# Altium schematic sheet Power_Sheet.SchDoc (part 2 of 3)
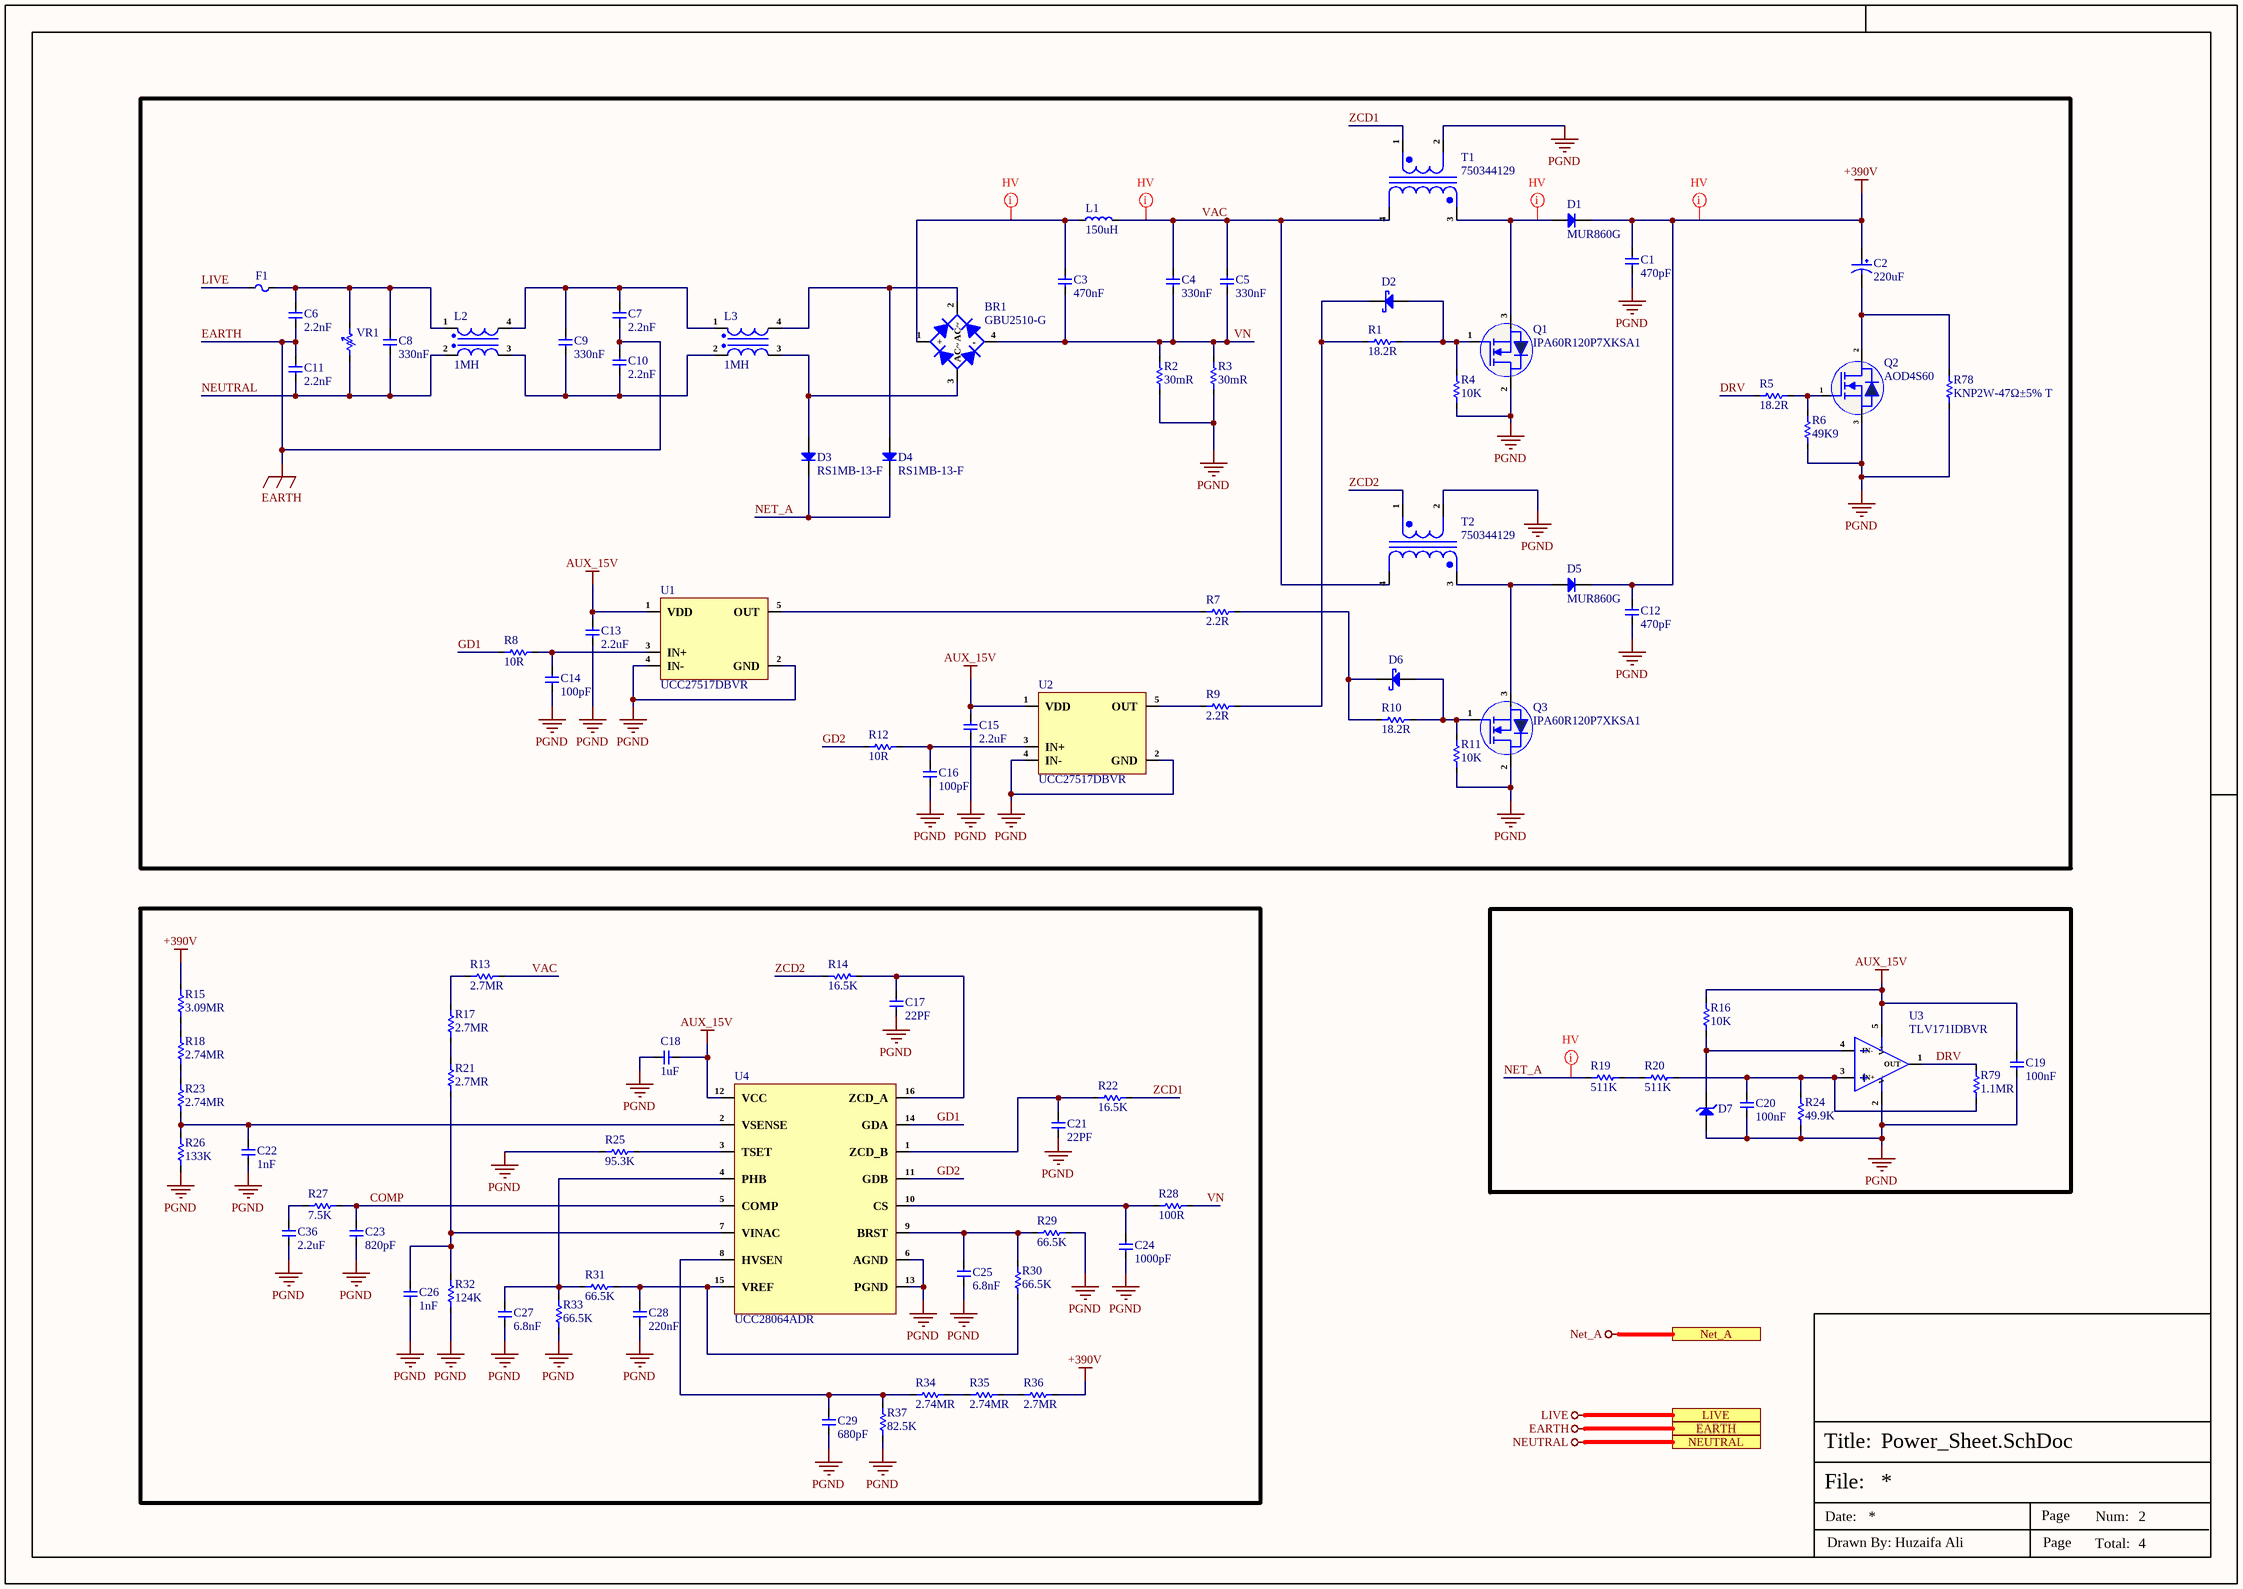
[diagram p1: Power_Sheet.SchDoc]
## Library data of the parts
BR1 = GBU2510-G: BRIDGE RECT 1PHASE 1KV 25A GBU; Manufacturer: Comchip; Item Type: Bridge Rectifier; Max Surge Current: 350A; Max Reverse Leakage Current: 10uA; Supplier: Arrow Electronics; LCSC Part Number: C3012677; Manufacturer Part Number: GBU2510-G; RoHS: Yes; Stock: 26; Pricing: 26=1.143, 100=1.0083, 500=0.9074, 1000=0.8027 (USD); Mounting Technology: Through Hole; Min Operating Temperature: -55°C; Max Operating Temperature: 150°C; Package Quantity: 200; Packaging: Rail/Tube; Series: -; Average Rectified Current: 25A; Lead Free: Lead Free; RoHS Compliant: Yes; ComponentLink1URL: https://datasheet.ciiva.com/886/gbu25005-gthru-gbu2510-grevc-886136.pdf?src-supplier=Digikey; ComponentLink1Description: https://datasheet.ciiva.com/886/gbu25005-gthru-gbu2510-grevc-886136.pdf?src-supplier=Digikey
C1 C12 = CC0805KRX7RBBB471: CAP CER 470PF 500V X7R 0805; Manufacturer: Yageo; Item Type: Capacitors; Tolerance: 10%; Supplier: Arrow Electronics; LCSC Part Number: C113867; Manufacturer Part Number: CC0805KRX7RBBB471; RoHS: Yes; Stock: 16000; Pricing: 4000=0.0157, 8000=0.0139, 24000=0.013, 48000=0.0125, 100000=0.0094 (USD); Mounting Technology: Surface Mount; Case/Package: 0805; Case Code (Imperial): 0805; Case Code (Metric): 2012; Min Operating Temperature: -55°C; Max Operating Temperature: 125°C; Voltage Rating (DC): 500V; Value: 470pF; Packaging: Tape and Reel; Package Quantity: 4000; Dielectric: X7R; Voltage Rating: 500V; Series: CC; Length: 0.079inch; Width: 0.049inch; Thickness: 0.037inch; RoHS Compliant: Yes; ComponentLink1URL: http://www.mouser.com/ds/2/447/Yageo_UPY-GP_NP0_16V-to-50V_9-358835.pdf?src-supplier=Mouser; ComponentLink1Description: http://www.mouser.com/ds/2/447/Yageo_UPY-GP_NP0_16V-to-50V_9-358835.pdf?src-supplier=Mouser; ComponentLink2URL: https://www.yageo.com/upload/media/product/products/datasheet/mlcc/UPY-NP0X7R_MV_100-to-630V_21.pdf?src-supplier=Digikey; ComponentLink2Description: https://www.yageo.com/upload/media/product/products/datasheet/mlcc/UPY-NP0X7R_MV_100-to-630V_21.pdf?src-supplier=Digikey; ComponentLink3URL: http://www.yageo.com/documents/recent/UPY-NP0X7R_MV_100-to-630V_19.pdf?src-supplier=Digikey; ComponentLink3Description: http://www.yageo.com/documents/recent/UPY-NP0X7R_MV_100-to-630V_19.pdf?src-supplier=Digikey
C2 = EWH2GM221O40OT: 220uF 400V ±20% Plugin,D22xL40mm Aluminum Electrolytic Capacitors - Leaded ROHS; Manufacturer: AISHI; Manufacturer Part Number: EWH2GM221O40OT; Package: Plugin,D22xL40mm; LCSC Part Number: C2988885; Item Type: Capacitors; ComponentLink1Description: LCSC; ComponentLink1URL: https://www.lcsc.com/product-detail/Aluminum-Electrolytic-Capacitors-Leaded_AISHI-Aihua-Group-EWH2GM221O40OT_C2988885.html
C3 = 450MPK474J: CAP FILM 0.47UF 5% 450VDC RADIAL; Manufacturer: Rubycon; Item Type: Film Capacitors; Dielectric Material: Polypropylene; Voltage Rating (DC): 450V; Supplier: Digikey; LCSC Part Number: C2798220; Manufacturer Part Number: 450MPK474J; RoHS: Yes; Stock: 4083; Pricing: 1=0.84, 10=0.605, 100=0.4311, 4000=0.26942, 8000=0.25962, 12000=0.25531 (USD); Mounting Technology: Through Hole; Case/Package: Radial; Min Operating Temperature: -40°C; Max Operating Temperature: 105°C; Package Quantity: 1; Value: 470nF; Tolerance: 5%; Packaging: Cut Tape; Termination: PC Pins; Series: MPK; Length: 0.709inch; Width: 0.256inch; Height - Seated (Max): 0.433inch; Lead Pitch: 0.591inch; RoHS Compliant: Yes; ComponentLink1URL: https://datasheet.ciiva.com/6281/e-mpk-6281321.pdf?src-supplier=Digikey; ComponentLink1Description: https://datasheet.ciiva.com/6281/e-mpk-6281321.pdf?src-supplier=Digikey; ComponentLink2URL: https://datasheet.ciiva.com/15021/e-mpk-15021932.pdf?src-supplier=Digikey; ComponentLink2Description: https://datasheet.ciiva.com/15021/e-mpk-15021932.pdf?src-supplier=Digikey
C4 C5 = MPP334J2J15AJ22800: 330nF -40℃~+105℃ ±5% 630V Plugin,P=15mm Polypropylene Film Capacitors (CBB) ROHS; Manufacturer: KNSCHA; Supplier: LCSC; LCSC Part Number: C506837; Manufacturer Part Number: MPP334J2J15AJ22800; RoHS: No; Item Type: Capacitors
C6 C7 C10 C11 = AY1222M47Y5UC63L0: CAP CER 2200PF 760VAC Y5U RADIAL; Item Type: Capacitor; LCSC Part Number: C1620433; ComponentLink1Description: LCSC; Supplier: Mouser; Supplier Part Number: 72-AY1222M47Y5UC63L0; RoHS: No; Category: Ceramic Capacitors; Stock: 23960; Pricing: 1=0.72, 10=0.395, 50=0.395, 100=0.326, 1000=0.216, 10000=0.19 (USD); ComponentLink2URL: http://www.farnell.com/datasheets/2719986.pdf?src-supplier=Farnell; ComponentLink2Description: http://www.farnell.com/datasheets/2719986.pdf?src-supplier=Farnell
C8 C9 = MPX334K31D2KN15800: 330nF ±10% X2 Plugin,P=15mm Safety Capacitors ROHS; Manufacturer: KNSCHA; Manufacturer Part Number: MPX334K31D2KN15800; Package: Plugin,P=15mm; LCSC Part Number: C504201; Item Type: Capacitors; ComponentLink1Description: LCSC; ComponentLink1URL: https://www.lcsc.com/product-detail/Safety-Capacitors_KNSCHA-MPX334K31D2KN15800_C504201.html
C13 C15 = CC0603KRX5R8BB225: CAP CER 2.2UF 25V X5R 0603; Manufacturer: Yageo; Tolerance: 10%; Item Type: Capacitor; Supplier 1: Digi-Key; Manufacturer Part Number: CC0603KRX5R8BB225; Stock 1: 687936; Pricing 1: 1=0.4, 10=0.276, 50=0.1932, 100=0.1656, 500=0.1242, 1000=0.10488 (USD); Mount: Surface Mount; Case/Package: 0603; Case Code (Metric): 1608; Case Code (Imperial): 0603; Weight: 7.1E-05oz; Min Operating Temperature: -55°C; Max Operating Temperature: 85°C; Packaging: Tape and Reel; Capacitance: 2.2uF; Dielectric: X5R; Voltage Rating: 25V; Termination: SMD/SMT; Resistor Type: Ceramic; Voltage Rating (DC): 25V; Package Quantity: 4000; Length: 1.6mm; Width: 0.031inch; Thickness: 0.037inch; Depth: 0.8mm; Radiation Hardening: No; Lead Free: Lead Free; Halogen Free: Halogen Free; RoHS Compliant: Yes; ComponentLink1URL: https://www.verical.com/server-webapp/html/getDatasheet?partID=782757&src-supplier=Verical; ComponentLink1Description: https://www.verical.com/server-webapp/html/getDatasheet?partID=782757&src-supplier=Verical; Supplier Part Number 1: 311-1786-1-ND; LCSC Part Number: C309478
C14 C16 = CC0402JRNPO9BN101: CAP CER 100PF 50V C0G/NPO 0402; Manufacturer: Yageo; Dielectric Material: Ceramic; Tolerance: 5%; Dielectric: C0G; Temperature Coefficient: 30ppm/°C; Insulation Resistance: 100GR; Item Type: Capacitor; Supplier: Future Electronics; Supplier Part Number: 8934564; Manufacturer Part Number: CC0402JRNPO9BN101; RoHS: Yes; Category: Ceramic Capacitors; Stock: 11720000; Pricing: 10000=0.002, 40000=0.0019, 150000=0.0018, 400000=0.0018, 1000000=0.0017 (USD); Mounting Technology: Surface Mount; Case/Package: 0402; Pins: 2; Case Code (Imperial): 0402; Case Code (Metric): 1005; Min Operating Temperature: -55°C; Max Operating Temperature: 125°C; Value: 100pF; Voltage Rating: 50V; Voltage Rating (DC): 50V; Packaging: Tape and Reel; Package Quantity: 1; Termination: SMD/SMT; Voltage: 50V; Series: CC; Length: 1mm; Width: 0.02inch; Height: 0.5mm; Thickness: 0.022inch; Depth: 0.5mm; Radiation Hardening: No; RoHS Compliant: Yes; Reach SVHC Compliant: No; Lead Free: Lead Free; ComponentLink1URL: https://datasheet.ciiva.com/11786/0900766b80d84fbf-11786101.pdf?src-supplier=Rs; ComponentLink1Description: https://datasheet.ciiva.com/11786/0900766b80d84fbf-11786101.pdf?src-supplier=Rs; ComponentLink2URL: https://datasheet.ciiva.com/23767/25787-23767888.pdf?src-supplier=Newark; ComponentLink2Description: https://datasheet.ciiva.com/23767/25787-23767888.pdf?src-supplier=Newark; ComponentLink3URL: https://datasheet.ciiva.com/28450/1443161-28450220.pdf?src-supplier=Element14; ComponentLink3Description: https://datasheet.ciiva.com/28450/1443161-28450220.pdf?src-supplier=Element14; ComponentLink4URL: https://datasheet.ciiva.com/8033/1443161-8033598.pdf?src-supplier=Element14; ComponentLink4Description: https://datasheet.ciiva.com/8033/1443161-8033598.pdf?src-supplier=Element14; ComponentLink5URL: https://datasheet.ciiva.com/143/mlccorderingcode-143990.pdf?src-supplier=Digi-Key; ComponentLink5Description: https://datasheet.ciiva.com/143/mlccorderingcode-143990.pdf?src-supplier=Digi-Key; ComponentLink6URL: https://datasheet.ciiva.com/143/mlccorderingcode-143989.pdf?src-supplier=Digi-Key; ComponentLink6Description: https://datasheet.ciiva.com/143/mlccorderingcode-143989.pdf?src-supplier=Digi-Key; ComponentLink7URL: https://datasheet.ciiva.com/143/mlccorderingcode-143991.pdf?src-supplier=Digi-Key; ComponentLink7Description: https://datasheet.ciiva.com/143/mlccorderingcode-143991.pdf?src-supplier=Digi-Key; LCSC Part Number: C106200
C17 C21 = CC0402JRNPO9BN220: CAP CER 22PF 50V C0G/NPO 0402; Manufacturer: Yageo; Dielectric Material: Ceramic; Tolerance: 5%; Dielectric: C0G; Temperature Coefficient: 30ppm/°C; Insulation Resistance: 100GR; Item Type: Capacitor; Supplier 1: Future Electronics; Manufacturer Part Number: CC0402JRNPO9BN220; RoHS: Yes; Category: Ceramic Capacitors; Stock 1: 200000; Pricing 1: 10000=0.00220, 40000=0.00210, 150000=0.00200, 400000=0.00190, 1000000=0.00180 (USD); Mounting Technology: Surface Mount; Case/Package: 0402; Pins: 2; Case Code (Metric): 1005; Case Code (Imperial): 0402; Min Operating Temperature: -55°C; Max Operating Temperature: 125°C; Value: 22pF; Voltage Rating: 50V; Packaging: Tape and Reel; Package Quantity: 1; Voltage Rating (DC): 50V; Termination: SMD/SMT; Resistor Type: Ceramic; Voltage: 50V; Series: CC; Length: 1mm; Width: 0.02inch; Height: 0.5mm; Thickness: 0.022inch; Depth: 0.5mm; Radiation Hardening: No; Reach SVHC Compliant: Yes; Lead Free: Lead Free; RoHS Compliant: Yes; ComponentLink1URL: https://datasheet.ciiva.com/5789/1443161-5789509.pdf?src-supplier=Farnell; ComponentLink1Description: https://datasheet.ciiva.com/5789/1443161-5789509.pdf?src-supplier=Farnell; ComponentLink2URL: https://datasheet.ciiva.com/8033/1443161-8033606.pdf?src-supplier=Element14; ComponentLink2Description: https://datasheet.ciiva.com/8033/1443161-8033606.pdf?src-supplier=Element14; ComponentLink3URL: https://datasheet.ciiva.com/7656/1132289-7656615.pdf?src-supplier=Element14; ComponentLink3Description: https://datasheet.ciiva.com/7656/1132289-7656615.pdf?src-supplier=Element14; ComponentLink4URL: https://datasheet.ciiva.com/8033/1443161-8033607.pdf?src-supplier=Element14; ComponentLink4Description: https://datasheet.ciiva.com/8033/1443161-8033607.pdf?src-supplier=Element14; ComponentLink5URL: https://datasheet.ciiva.com/8033/1443161-8033605.pdf?src-supplier=Element14; ComponentLink5Description: https://datasheet.ciiva.com/8033/1443161-8033605.pdf?src-supplier=Element14; ComponentLink6URL: https://datasheet.ciiva.com/143/mlccorderingcode-143987.pdf?src-supplier=Digi-Key; ComponentLink6Description: https://datasheet.ciiva.com/143/mlccorderingcode-143987.pdf?src-supplier=Digi-Key; ComponentLink7URL: https://datasheet.ciiva.com/143/mlccorderingcode-143986.pdf?src-supplier=Digi-Key; ComponentLink7Description: https://datasheet.ciiva.com/143/mlccorderingcode-143986.pdf?src-supplier=Digi-Key; ComponentLink8URL: https://datasheet.ciiva.com/143/mlccorderingcode-143988.pdf?src-supplier=Digi-Key; ComponentLink8Description: https://datasheet.ciiva.com/143/mlccorderingcode-143988.pdf?src-supplier=Digi-Key; ComponentLink9URL: https://datasheet.ciiva.com/5425/upy-gp-np0-16v-to-50v-8-5425483.pdf?src-supplier=Mouser; ComponentLink9Description: https://datasheet.ciiva.com/5425/upy-gp-np0-16v-to-50v-8-5425483.pdf?src-supplier=Mouser; ComponentLink10URL: https://datasheet.ciiva.com/15189/getdatasheetpartid-370074-15189117.pdf?src-supplier=Verical; ComponentLink10Description: https://datasheet.ciiva.com/15189/getdatasheetpartid-370074-15189117.pdf?src-supplier=Verical; Supplier Part Number 1: 9105957; LCSC Part Number: C106203
C18 = CC0603KRX5R8BB105: CAP CER 1UF 25V X5R 0603; Manufacturer: Yageo; Tolerance: 10%; Item Type: Capacitor; Supplier 1: Digi-Key; Manufacturer Part Number: CC0603KRX5R8BB105; RoHS: Yes; Category: Ceramic Capacitors; Stock 1: 919939; Pricing 1: 1=0.12000, 10=0.08400, 50=0.04760, 100=0.03940, 500=0.02764, 1000=0.02288 (USD); Mount: Surface Mount; Case/Package: 0603; Number of Pins: 2; Case Code (Metric): 1608; Case Code (Imperial): 0603; Min Operating Temperature: -55°C; Max Operating Temperature: 85°C; Capacitance: 1uF; Dielectric: X5R; Package Quantity: 1; Voltage Rating: 25V; Packaging: Tape and Reel; Termination: SMD/SMT; Voltage Rating (DC): 25V; Series: CC; Construction: Flat; Length: 1.6mm; Width: 0.031inch; Height: 0.8mm; Thickness: 0.035inch; Depth: 0.8mm; Radiation Hardening: No; REACH SVHC: No SVHC; Lead Free: Lead Free; Halogen Free: Halogen Free; RoHS Compliant: Yes; ComponentLink1URL: https://datasheet.ciiva.com/176/mlccorderingcode-176785.pdf?src-supplier=Digi-Key; ComponentLink1Description: https://datasheet.ciiva.com/176/mlccorderingcode-176785.pdf?src-supplier=Digi-Key; ComponentLink2URL: https://datasheet.ciiva.com/176/mlccorderingcode-176786.pdf?src-supplier=Digi-Key; ComponentLink2Description: https://datasheet.ciiva.com/176/mlccorderingcode-176786.pdf?src-supplier=Digi-Key; ComponentLink3URL: https://datasheet.ciiva.com/176/mlccorderingcode-176787.pdf?src-supplier=Digi-Key; ComponentLink3Description: https://datasheet.ciiva.com/176/mlccorderingcode-176787.pdf?src-supplier=Digi-Key; ComponentLink4URL: https://datasheet.ciiva.com/17436/upy-gphc-x5r-4v-to-50v-12-17436952.pdf?src-supplier=Avnet+Europe; ComponentLink4Description: https://datasheet.ciiva.com/17436/upy-gphc-x5r-4v-to-50v-12-17436952.pdf?src-supplier=Avnet+Europe; ComponentLink5URL: https://datasheet.ciiva.com/7978/1525783-7978171.pdf?src-supplier=Element14; ComponentLink5Description: https://datasheet.ciiva.com/7978/1525783-7978171.pdf?src-supplier=Element14; ComponentLink6URL: https://datasheet.ciiva.com/11586/upy-gphc-x5r-4v-to-50v-12-11586318.pdf?src-supplier=Avnet; ComponentLink6Description: https://datasheet.ciiva.com/11586/upy-gphc-x5r-4v-to-50v-12-11586318.pdf?src-supplier=Avnet; Supplier Part Number 1: 311-1445-1-ND; LCSC Part Number: C14664
C19 C20 = C1005X7R1H104KT000F: CAP CER 0.1UF 50V X7R 0402; Manufacturer: TDK; Tolerance: 10%; Voltage: 25V; Item Type: Capacitor; Supplier 1: Avnet; Manufacturer Part Number: C1005X7R1H104KT000F; RoHS: No; Category: Ceramic Capacitors; Dielectric: X7R; Supplier Part Number 1: C1005X7R1H104KT000F; LCSC Part Number: C361198; ComponentLink1Description: LCSC; ComponentLink1URL: https://www.lcsc.com/product-detail/Multilayer-Ceramic-Capacitors-MLCC-SMD-SMT_TDK-C1005X7R1H104KT000F_C361198.html
C22 = GRM1555C1H102JA01D: CAP CER 1000PF 50V C0G/NP0 0402; Manufacturer: Murata; Material: Ceramic; Tolerance: 5%; Dielectric: C0G; Insulation Resistance: 10GR; Temperature Coefficient: 30ppm/°C; Item Type: Capacitor; Supplier 1: Avnet; Manufacturer Part Number: GRM1555C1H102JA01D; RoHS: Yes; Category: Ceramic Capacitors; Stock 1: 800000; Pricing 1: 10000=0.00648, 20000=0.00613, 40000=0.00578, 60000=0.00543, 80000=0.00508, 100000=0.00473, 1000000=0.00438 (USD); Mount: Surface Mount; Case/Package: 0402; Number of Pins: 2; Case Code (Metric): 1005; Case Code (Imperial): 0402; Dielectric Material: Ceramic; Min Operating Temperature: -55°C; Max Operating Temperature: 125°C; Package Quantity: 1; Capacitance: 1nF; Voltage Rating: 50V; Packaging: Tape and Reel; Voltage Rating (DC): 50V; Termination: SMD/SMT; Voltage: 50V; Series: GRM; Construction: Flat; Length: 1mm; Width: 0.5mm; Height: 0.5mm; Thickness: 0.022inch; Depth: 0.5mm; Size: 0.5mm; Radiation Hardening: No; Reach SVHC Compliant: Yes; Lead Free: Lead Free; RoHS Compliant: Yes; ComponentLink1URL: https://datasheet.ciiva.com/34302/1855908-34302849.pdf?src-supplier=Jameco; ComponentLink1Description: https://datasheet.ciiva.com/34302/1855908-34302849.pdf?src-supplier=Jameco; ComponentLink2URL: https://datasheet.ciiva.com/132/product-132800.pdf?src-supplier=Digi-Key; ComponentLink2Description: https://datasheet.ciiva.com/132/product-132800.pdf?src-supplier=Digi-Key; ComponentLink3URL: https://datasheet.ciiva.com/132/grm1555c1h102ja01-01-132799.pdf?src-supplier=Digi-Key; ComponentLink3Description: https://datasheet.ciiva.com/132/grm1555c1h102ja01-01-132799.pdf?src-supplier=Digi-Key; ComponentLink4URL: https://datasheet.ciiva.com/11786/0900766b807a1cab-11786727.pdf?src-supplier=RSComponents; ComponentLink4Description: https://datasheet.ciiva.com/11786/0900766b807a1cab-11786727.pdf?src-supplier=RSComponents; ComponentLink5URL: https://datasheet.ciiva.com/29200/453569-da-01-en-vs-kondensator-0402-29200121.pdf?src-supplier=Conrad; ComponentLink5Description: https://datasheet.ciiva.com/29200/453569-da-01-en-vs-kondensator-0402-29200121.pdf?src-supplier=Conrad; ComponentLink6URL: https://datasheet.ciiva.com/7828/4360-7828821.pdf?src-supplier=Element14; ComponentLink6Description: https://datasheet.ciiva.com/7828/4360-7828821.pdf?src-supplier=Element14; ComponentLink7URL: https://datasheet.ciiva.com/14116/grmseries-tc-hitype-eng-14116919.pdf?src-supplier=Distrelec; ComponentLink7Description: https://datasheet.ciiva.com/14116/grmseries-tc-hitype-eng-14116919.pdf?src-supplier=Distrelec; ComponentLink8URL: https://datasheet.ciiva.com/14116/grmseries-tc-hitype-eng-14116858.pdf?src-supplier=Distrelec; ComponentLink8Description: https://datasheet.ciiva.com/14116/grmseries-tc-hitype-eng-14116858.pdf?src-supplier=Distrelec; ComponentLink9URL: https://datasheet.ciiva.com/132/grm1555c1h102ja01-01-132801.pdf?src-supplier=Digi-Key; ComponentLink9Description: https://datasheet.ciiva.com/132/grm1555c1h102ja01-01-132801.pdf?src-supplier=Digi-Key; ComponentLink10URL: https://datasheet.ciiva.com/7828/1747436-7828822.pdf?src-supplier=Element14; ComponentLink10Description: https://datasheet.ciiva.com/7828/1747436-7828822.pdf?src-supplier=Element14; Supplier Part Number 1: GRM1555C1H102JA01D; LCSC Part Number: C76947
C23 = CC0603JRNPO9BN821: CAP CER 820PF 50V C0G/NPO 0603; Manufacturer: Yageo; Item Type: Capacitors; Tolerance: 5%; Dielectric: C0G; Supplier: Arrow Electronics; LCSC Part Number: C107057; Manufacturer Part Number: CC0603JRNPO9BN821; RoHS: Yes; Stock: 772000; Pricing: 4000=0.0129, 24000=0.0087, 48000=0.0086 (USD); Mounting Technology: Surface Mount; Case/Package: 0603; Pins: 2; Case Code (Imperial): 0603; Case Code (Metric): 1608; Min Operating Temperature: -55°C; Max Operating Temperature: 125°C; Packaging: Tape and Reel; Value: 820pF; Voltage Rating: 50V; Voltage Rating (DC): 50V; Termination: SMD/SMT; Series: CC; Length: 1.6mm; Width: 0.031inch; Height: 0.8mm; Thickness: 0.035inch; Depth: 0.8mm; Radiation Hardening: No; Lead Free: Lead Free; RoHS Compliant: Yes; ComponentLink1URL: https://datasheet.ciiva.com/26829/getdatasheetpartid-403541-26829388.pdf?src-supplier=Verical; ComponentLink1Description: https://datasheet.ciiva.com/26829/getdatasheetpartid-403541-26829388.pdf?src-supplier=Verical
C24 = CL10C102JB8NNNC: CAP CER 1000PF 50V C0G/NP0 0603; Manufacturer: Samsung; Material: Ceramic; Tolerance: 5%; Capacitance: 1nF; Dielectric: C0G; Temperature Coefficient: 300ppm/°C; Item Type: Capacitor; Supplier 1: RSComponents; Manufacturer Part Number: CL10C102JB8NNNC; RoHS: Yes; Category: Ceramic Capacitors; Stock 1: 616000; Pricing 1: 4000=0.00600, 12000=0.00600, 20000=0.00600, 40000=0.00500, 100000=0.00500 (GBP); Mount: Surface Mount; Case/Package: 0603; Case Code (Metric): 1608; Case Code (Imperial): 0603; Min Operating Temperature: -55°C; Max Operating Temperature: 125°C; Voltage: 50V; Voltage Rating (DC): 50V; Voltage Rating: 50V; Packaging: Tape and Reel; Package Quantity: 1; Series: CL; Length: 1.6mm; Width: 0.031inch; Height: 0.8mm; Depth: 0.8mm; Thickness: 0.035inch; Radiation Hardening: No; Lead Free: Lead Free; RoHS Compliant: Yes; ComponentLink1URL: https://datasheet.ciiva.com/15195/getdatasheetpartid-354056-15195790.pdf?src-supplier=Verical; ComponentLink1Description: https://datasheet.ciiva.com/15195/getdatasheetpartid-354056-15195790.pdf?src-supplier=Verical; ComponentLink2URL: https://datasheet.ciiva.com/29198/458273-da-01-en-vs-kondensator-0603-29198494.pdf?src-supplier=Conrad; ComponentLink2Description: https://datasheet.ciiva.com/29198/458273-da-01-en-vs-kondensator-0603-29198494.pdf?src-supplier=Conrad; ComponentLink3URL: https://datasheet.ciiva.com/26310/mlcc-catalogdownload2013-eng-26310329.pdf?src-supplier=Distrelec; ComponentLink3Description: https://datasheet.ciiva.com/26310/mlcc-catalogdownload2013-eng-26310329.pdf?src-supplier=Distrelec; Supplier Part Number 1: 7665279; LCSC Part Number: C163508
C25 C27 = 0603B682K500NT: 50V 6.8nF X7R ±10% 0603; Manufacturer: FH; Item Type: Capacitor; ComponentLink1Description: LCSC; ComponentLink1URL: https://www.lcsc.com/product-detail/Multilayer-Ceramic-Capacitors-MLCC-SMD-SMT_FH-Guangdong-Fenghua-Advanced-Tech-0603B682K500NT_C1631.html; Manufacturer Part Number: 0603B682K500NT; Footprint: 0603; Value: 6.8nF; LCSC Part Number: C1631
C26 = 06031C102JAT2A: CAP CER 1000PF 100V X7R 0603; Manufacturer: Kyocera AVX; Item Type: Capacitor; Material: 4241ConductorMaterial; Supplier: Future Electronics; LCSC Part Number: C2179225; Manufacturer Part Number: 06031C102JAT2A; RoHS: Yes; Stock: 32000; Pricing: 4000=0.0243, 12000=0.0234, 20000=0.023, 40000=0.0225, 80000=0.0216 (USD); Lead Free: 5697LeadFree; ComponentLink1URL: https://datasheet.ciiva.com/27056/2011951-27056177.pdf?src-supplier=Jameco; ComponentLink1Description: https://datasheet.ciiva.com/27056/2011951-27056177.pdf?src-supplier=Jameco; ComponentLink2URL: https://datasheet.ciiva.com/2987/cx7r-2987732.pdf?src-supplier=Avnet; ComponentLink2Description: https://datasheet.ciiva.com/2987/cx7r-2987732.pdf?src-supplier=Avnet; ComponentLink3URL: https://datasheet.ciiva.com/151/cx7r-151600.pdf?src-supplier=Digikey; ComponentLink3Description: https://datasheet.ciiva.com/151/cx7r-151600.pdf?src-supplier=Digikey; ComponentLink4URL: https://datasheet.ciiva.com/151/cx7r-151601.pdf?src-supplier=Digikey; ComponentLink4Description: https://datasheet.ciiva.com/151/cx7r-151601.pdf?src-supplier=Digikey; ComponentLink5URL: https://datasheet.ciiva.com/151/cx7r-151602.pdf?src-supplier=Digikey; ComponentLink5Description: https://datasheet.ciiva.com/151/cx7r-151602.pdf?src-supplier=Digikey; ComponentLink6URL: https://datasheet.ciiva.com/1124/1679506-1124194.pdf?src-supplier=Element14; ComponentLink6Description: https://datasheet.ciiva.com/1124/1679506-1124194.pdf?src-supplier=Element14; ComponentLink7URL: https://datasheet.ciiva.com/1124/1679506-1124195.pdf?src-supplier=Element14; ComponentLink7Description: https://datasheet.ciiva.com/1124/1679506-1124195.pdf?src-supplier=Element14; ComponentLink8URL: https://datasheet.ciiva.com/7855/1679506-7855032.pdf?src-supplier=Element14; ComponentLink8Description: https://datasheet.ciiva.com/7855/1679506-7855032.pdf?src-supplier=Element14; ComponentLink9URL: https://datasheet.ciiva.com/16286/cx7r-16286463.pdf?src-supplier=Future+Electronics; ComponentLink9Description: https://datasheet.ciiva.com/16286/cx7r-16286463.pdf?src-supplier=Future+Electronics
C28 = CC1206JKX7R9BB224: CAP CER 0.22UF 50V X7R 1206; Manufacturer: Yageo; Item Type: Capacitor; Supplier: Future Electronics; Supplier Part Number: 4639209; Manufacturer Part Number: CC1206JKX7R9BB224; RoHS: Yes; Category: Ceramic Capacitors; Stock: 3000; Pricing: 3000=0.0381, 9000=0.0366, 15000=0.036, 30000=0.0351, 60000=0.0337 (USD); ComponentLink1URL: https://datasheet.ciiva.com/13210/upy-gp-np0-16v-to-50v-8-13210060.pdf?src-supplier=Mouser; ComponentLink1Description: https://datasheet.ciiva.com/13210/upy-gp-np0-16v-to-50v-8-13210060.pdf?src-supplier=Mouser; ComponentLink2URL: https://datasheet.ciiva.com/11466/upy-gphc-x7r-6-3v-to-50v-8-11466351.pdf?src-supplier=Avnet; ComponentLink2Description: https://datasheet.ciiva.com/11466/upy-gphc-x7r-6-3v-to-50v-8-11466351.pdf?src-supplier=Avnet; LCSC Part Number: C527274
C29 = CC0603JRNPO9BN681: CAP CER 680PF 50V C0G/NPO 0603; Manufacturer: Yageo; Item Type: Capacitors; Insulation Resistance: 100GR; Supplier: Arrow Electronics; LCSC Part Number: C107055; Manufacturer Part Number: CC0603JRNPO9BN681; RoHS: Yes; Stock: 1227; Pricing: 1=0.0632, 10=0.035, 25=0.0308, 100=0.0222, 250=0.0221, 500=0.022, 1000=0.0132 (USD); Voltage Rating (AC): 50V; Halogen Free: 5694HalogenFree; Lead Free: 5697LeadFree; ComponentLink1URL: https://datasheet.ciiva.com/11786/0900766b8079c870-11786425.pdf?src-supplier=Rs; ComponentLink1Description: https://datasheet.ciiva.com/11786/0900766b8079c870-11786425.pdf?src-supplier=Rs; ComponentLink2URL: https://datasheet.ciiva.com/7978/1132289-7978154.pdf?src-supplier=Element14; ComponentLink2Description: https://datasheet.ciiva.com/7978/1132289-7978154.pdf?src-supplier=Element14; ComponentLink3URL: https://datasheet.ciiva.com/11587/upy-gp-np0-16v-to-50v-8-11587327.pdf?src-supplier=Avnet; ComponentLink3Description: https://datasheet.ciiva.com/11587/upy-gp-np0-16v-to-50v-8-11587327.pdf?src-supplier=Avnet; ComponentLink4URL: https://datasheet.ciiva.com/176/mlccorderingcode-176594.pdf?src-supplier=Digikey; ComponentLink4Description: https://datasheet.ciiva.com/176/mlccorderingcode-176594.pdf?src-supplier=Digikey; ComponentLink5URL: https://datasheet.ciiva.com/176/mlccorderingcode-176595.pdf?src-supplier=Digikey; ComponentLink5Description: https://datasheet.ciiva.com/176/mlccorderingcode-176595.pdf?src-supplier=Digikey; ComponentLink6URL: https://datasheet.ciiva.com/176/mlccorderingcode-176596.pdf?src-supplier=Digikey; ComponentLink6Description: https://datasheet.ciiva.com/176/mlccorderingcode-176596.pdf?src-supplier=Digikey; ComponentLink7URL: https://datasheet.ciiva.com/15165/getdatasheetpartid-26164-15165031.pdf?src-supplier=Verical; ComponentLink7Description: https://datasheet.ciiva.com/15165/getdatasheetpartid-26164-15165031.pdf?src-supplier=Verical
C36 = CC0805KKX5R8BB225: CAP CER 2.2UF 25V X5R 0805; Manufacturer: Yageo; Tolerance: 10%; Supplier 1: Mouser; Manufacturer Part Number: CC0805KKX5R8BB225; RoHS: Yes; Category: Ceramic Capacitors; Stock 1: 2849; Pricing 1: 1=0.33000, 10=0.15100, 50=0.15100, 100=0.14800, 500=0.14600, 1000=0.14500, 3000=0.14400, 10000=0.14400 (USD); Mount: Surface Mount; Case/Package: 0805; Case Code (Metric): 2012; Case Code (Imperial): 0805; Min Operating Temperature: -55°C; Max Operating Temperature: 85°C; Capacitance: 2.2uF; Dielectric: X5R; Voltage Rating: 25V; Voltage Rating (DC): 25V; Packaging: Tape and Reel; Resistor Type: Ceramic; Series: CC; Construction: Flat; Length: 2mm; Width: 0.049inch; Height: 0.85mm; Depth: 1.25mm; Thickness: 0.057inch; Radiation Hardening: No; Lead Free: Lead Free; Halogen Free: Halogen Free; RoHS Compliant: Yes; ComponentLink1URL: https://datasheet.ciiva.com/11583/upy-gphc-x5r-4v-to-50v-12-11583590.pdf?src-supplier=Avnet; ComponentLink1Description: https://datasheet.ciiva.com/11583/upy-gphc-x5r-4v-to-50v-12-11583590.pdf?src-supplier=Avnet; Supplier Part Number 1: 603-CC805KKX5R8BB225; LCSC Part Number: C277526
D1 D5 = MUR860G: DIODE GEN PURP 600V 8A TO220-2; Manufacturer: ON Semiconductor; Supplier: Future Electronics; LCSC Part Number: C50428; Manufacturer Part Number: MUR860G; RoHS: Yes; Item Type: Diode; Stock: 4012; Pricing: 50=0.565, 200=0.54, 750=0.515, 1500=0.505, 3750=0.475 (USD); ComponentLink1URL: https://datasheet.ciiva.com/14169/zamur840-860-data-e-14169160.pdf?src-supplier=Distrelec; ComponentLink1Description: https://datasheet.ciiva.com/14169/zamur840-860-data-e-14169160.pdf?src-supplier=Distrelec; ComponentLink2URL: https://datasheet.ciiva.com/15144/getdatasheetpartid-103084-15144871.pdf?src-supplier=Verical; ComponentLink2Description: https://datasheet.ciiva.com/15144/getdatasheetpartid-103084-15144871.pdf?src-supplier=Verical; ComponentLink3URL: https://datasheet.ciiva.com/14557/70099562-14557677.pdf?src-supplier=Allied+Electronics; ComponentLink3Description: https://datasheet.ciiva.com/14557/70099562-14557677.pdf?src-supplier=Allied+Electronics; ComponentLink4URL: https://datasheet.ciiva.com/8299/mur820-d-8299771.pdf?src-supplier=Avnet; ComponentLink4Description: https://datasheet.ciiva.com/8299/mur820-d-8299771.pdf?src-supplier=Avnet; ComponentLink5URL: https://datasheet.ciiva.com/916/mur820-d-916462.pdf?src-supplier=Digikey; ComponentLink5Description: https://datasheet.ciiva.com/916/mur820-d-916462.pdf?src-supplier=Digikey; ComponentLink6URL: https://datasheet.ciiva.com/16210/mur820-d-16210191.pdf?src-supplier=Future+Electronics; ComponentLink6Description: https://datasheet.ciiva.com/16210/mur820-d-16210191.pdf?src-supplier=Future+Electronics
D2 D6 = BAT54HT1G: 30V Independent Type 1V@100mA 200mA SOD-323 Schottky Diodes ROHS; Manufacturer: FUXINSEMI; Item Type: Diode; Manufacturer Part Number: BAT54HT1G; Package: SOD-323; LCSC Part Number: C7422626; ComponentLink1Description: LCSC; ComponentLink1URL: https://www.lcsc.com/product-detail/Schottky-Diodes_FUXINSEMI-BAT54HT1G_C7422626.html
D3 D4 = RS1MB-13-F: DIODE GEN PURP 1KV 1A SMB; Manufacturer: Diodes; Max Reverse Current: 5uA; Reverse Recovery Time: 500ns; Peak Non-Repetitive Surge Current: 30A; Forward Voltage: 1.3V; Polarity: Standard; Value: 15pF; Supplier: Future Electronics; LCSC Part Number: C154864; Manufacturer Part Number: RS1MB-13-F; RoHS: Yes; Item Type: Diodes; Stock: 45000; Pricing: 3000=0.0825, 6000=0.093, 9000=0.0794, 12000=0.0905, 15000=0.078, 30000=0.0761, 60000=0.0732 (USD); Mounting Technology: Surface Mount; Case/Package: SMB; Pins: 2; Weight: 0.00328oz; Min Operating Temperature: -65°C; Max Operating Temperature: 150°C; Package Quantity: 3000; Packaging: Tape and Reel; Forward Current: 1A; Max Repetitive Reverse Voltage (Vrrm): 1kV; Output Current: 1A; Series: -; Max Surge Current: 30A; Recovery Time: 500ns; Reverse Voltage (DC): 1kV; Average Rectified Current: 1A; Voltage Rating (DC): 1kV; Current Rating: 1A; Max Reverse Voltage (DC): 1kV; Reverse Recovery Time-Max: 500ns; Length: 4.57mm; Width: 3.94mm; Height: 2.42mm; Radiation Hardening: No; Lead Free: Lead Free; RoHS Compliant: Yes; ComponentLink1URL: https://datasheet.ciiva.com/8301/ds15002-8301721.pdf?src-supplier=Avnet; ComponentLink1Description: https://datasheet.ciiva.com/8301/ds15002-8301721.pdf?src-supplier=Avnet; ComponentLink2URL: https://datasheet.ciiva.com/26818/getdatasheetpartid-91887-26818092.pdf?src-supplier=Verical; ComponentLink2Description: https://datasheet.ciiva.com/26818/getdatasheetpartid-91887-26818092.pdf?src-supplier=Verical; ComponentLink3URL: https://datasheet.ciiva.com/8301/ds15002-8301350.pdf?src-supplier=Avnet; ComponentLink3Description: https://datasheet.ciiva.com/8301/ds15002-8301350.pdf?src-supplier=Avnet
D7 = BZT52C5V1S-7-F: DIODE ZENER 5.1V 200MW SOD323; Manufacturer: Diodes; Max Reverse Leakage Current: 1uA; Tolerance: 6%; Forward Voltage: 900mV; Impedance: 60R; Zener Current: 5mA; Output Current: 50mA; ESD Protection: No; Supplier: Future Electronics; LCSC Part Number: C151348; Manufacturer Part Number: BZT52C5V1S-7-F; RoHS: Yes; Item Type: Diodes; Stock: 30000; Pricing: 3000=0.0261, 9000=0.0252, 15000=0.0248, 60000=0.0236, 90000=0.0229 (USD); Mounting Technology: Surface Mount; Pins: 2; Weight: 0.000173oz; Contact Plating: Tin,Matte; Min Operating Temperature: -65°C; Max Operating Temperature: 150°C; Max Power Dissipation: 200mW; Zener Voltage: 5.1V; Packaging: Tape and Reel; Package Quantity: 3000; Power Dissipation: 200mW; Voltage Tolerance: 6%; Test Current: 5mA; Working Voltage: 5.1V; Max Reverse Current: 1uA; Termination: SMD/SMT; Power Rating: 200mW; Voltage Rating (DC): 5.1V; Series: -; Length: 1.8mm; Width: 1.4mm; Height: 1mm; Radiation Hardening: No; Lead Free: Lead Free; RoHS Compliant: Yes; ComponentLink1URL: https://datasheet.ciiva.com/15142/getdatasheetpartid-61177-15142295.pdf?src-supplier=Verical; ComponentLink1Description: https://datasheet.ciiva.com/15142/getdatasheetpartid-61177-15142295.pdf?src-supplier=Verical; ComponentLink2URL: https://datasheet.ciiva.com/25623/0900766b8104c1f1-25623741.pdf?src-supplier=Rs; ComponentLink2Description: https://datasheet.ciiva.com/25623/0900766b8104c1f1-25623741.pdf?src-supplier=Rs
F1 = 0501010.WR1: 150A SMD Fuse 10A 32V 1206 Disposable fuses ROHS; Manufacturer: Littelfuse; Manufacturer Part Number: 0501010.WR1; Package: 1206; LCSC Part Number: C207003; Item Type: Fuses; ComponentLink1Description: LCSC; ComponentLink1URL: https://www.lcsc.com/product-detail/Disposable-fuses_Littelfuse-0501010-WR1_C207003.html
L1 = 7447076: FIXED IND 150UH 5A 45 MOHM TH; Manufacturer: Wurth Electronics; Item Type: Inductors; Supplier: Mouser; Manufacturer Part Number: 7447076; RoHS: Yes; Stock: 602; Pricing: 1=5.45, 10=5.19, 50=4.84, 100=4.57, 1000=4.12, 10000=4.12 (USD); ComponentLink1URL: https://datasheet.ciiva.com/11796/0900766b804e2e81-11796524.pdf?src-supplier=Rs; ComponentLink1Description: https://datasheet.ciiva.com/11796/0900766b804e2e81-11796524.pdf?src-supplier=Rs; ComponentLink2URL: https://datasheet.ciiva.com/6697/7447076-6697107.pdf?src-supplier=Digikey; ComponentLink2Description: https://datasheet.ciiva.com/6697/7447076-6697107.pdf?src-supplier=Digikey; ComponentLink3URL: https://datasheet.ciiva.com/7695/7447076-7695687.pdf?src-supplier=Element14; ComponentLink3Description: https://datasheet.ciiva.com/7695/7447076-7695687.pdf?src-supplier=Element14; Supplier Part Number: 710-7447076
L2 L3 = 7448031501: CMC 1MH 15A 2LN TH; Manufacturer: Wurth Electronics; Number of Lines: 2; Voltage Rating (AC): 250V; Shielding: Unshielded; Tolerance: 50%; Test Frequency: 10kHz; Item Type: Inductor; Supplier: Mouser; Supplier Part Number: 710-7448031501; Manufacturer Part Number: 7448031501; RoHS: Yes; Category: Common Mode Chokes; Stock: 2629; Pricing: 1=12.9, 10=12.9, 50=11.34, 100=9.67, 1000=8.72, 10000=8.72 (USD); Mounting Technology: Through Hole; Case/Package: 300; Min Operating Temperature: -40°C; Max Operating Temperature: 125°C; Current Rating: 15A; Package Quantity: 90; Packaging: Bulk; Max Current Rating: 15A; Value: 1mH; Termination: Through Hole; Max DC Current: 15A; Series: WE-CMBNC; Length: 23mm; Width: 17mm; Height: 25mm; RoHS Compliant: Yes; Reach SVHC Compliant: Unknown; ComponentLink1URL: https://datasheet.ciiva.com/46423/1832949-46423388.pdf?src-supplier=Element14; ComponentLink1Description: https://datasheet.ciiva.com/46423/1832949-46423388.pdf?src-supplier=Element14
Q1 Q3 = IPA60R120P7XKSA1: MOSFET N-CH 600V 26A TO220; Manufacturer: Infineon; Item Type: MOSFETs; Drain to Source Resistance: 100mR; Gate to Source Voltage (Vgs): 20V; Number of Channels: 1NUMBER; On-State Resistance: 120mR; Power Dissipation: 28W; Turn-Off Delay Time: 81ns; Turn-On Delay Time: 21ns; Supplier: Mouser; Supplier Part Number: 726-IPA60R120P7XKSA1; Manufacturer Part Number: IPA60R120P7XKSA1; RoHS: Yes; Stock: 2795; Pricing: 1=2.99, 10=2.59, 50=2.37, 100=2.03, 1000=1.59, 10000=1.39 (USD); Drain to Source Breakdown Voltage: 600V; Package Quantity: 500NUMBER; Height: 18.1mm; ComponentLink1URL: http://datasheet.octopart.com/IPA60R120P7XKSA1-Infineon-datasheet-96908606.pdf?src-supplier=Future+Electronics; ComponentLink1Description: http://datasheet.octopart.com/IPA60R120P7XKSA1-Infineon-datasheet-96908606.pdf?src-supplier=Future+Electronics; ComponentLink2URL: http://datasheet.octopart.com/IPA60R120P7XKSA1-Infineon-datasheet-96908606.pdf?src-supplier=Digikey; ComponentLink2Description: http://datasheet.octopart.com/IPA60R120P7XKSA1-Infineon-datasheet-96908606.pdf?src-supplier=Digikey; ComponentLink3URL: http://datasheet.octopart.com/IPA60R120P7XKSA1-Infineon-datasheet-96908606.pdf?src-supplier=Farnell; ComponentLink3Description: http://datasheet.octopart.com/IPA60R120P7XKSA1-Infineon-datasheet-96908606.pdf?src-supplier=Farnell; ComponentLink4URL: http://datasheet.octopart.com/IPA60R120P7XKSA1-Infineon-datasheet-96908606.pdf?src-supplier=Newark; ComponentLink4Description: http://datasheet.octopart.com/IPA60R120P7XKSA1-Infineon-datasheet-96908606.pdf?src-supplier=Newark; ComponentLink5URL: http://datasheet.octopart.com/IPA60R120P7XKSA1-Infineon-datasheet-96908606.pdf?src-supplier=Avnet; ComponentLink5Description: http://datasheet.octopart.com/IPA60R120P7XKSA1-Infineon-datasheet-96908606.pdf?src-supplier=Avnet; ComponentLink6URL: http://datasheet.octopart.com/IPA60R120P7XKSA1-Infineon-datasheet-96908606.pdf?src-supplier=Rs; ComponentLink6Description: http://datasheet.octopart.com/IPA60R120P7XKSA1-Infineon-datasheet-96908606.pdf?src-supplier=Rs; ComponentLink7URL: http://datasheet.octopart.com/IPA60R120P7XKSA1-Infineon-datasheet-96908606.pdf?src-supplier=Mouser; ComponentLink7Description: http://datasheet.octopart.com/IPA60R120P7XKSA1-Infineon-datasheet-96908606.pdf?src-supplier=Mouser; ComponentLink8URL: https://datasheet.octopart.com/IPA60R120P7XKSA1-Infineon-datasheet-96908606.pdf?src-supplier=TME; ComponentLink8Description: https://datasheet.octopart.com/IPA60R120P7XKSA1-Infineon-datasheet-96908606.pdf?src-supplier=TME; ComponentLink9URL: http://datasheet.octopart.com/IPA60R120P7XKSA1-Infineon-datasheet-96908606.pdf?src-supplier=Rochester+Electronics; ComponentLink9Description: http://datasheet.octopart.com/IPA60R120P7XKSA1-Infineon-datasheet-96908606.pdf?src-supplier=Rochester+Electronics
Q2 = AOD4S60: MOSFET N-CH 600V 4A TO252; Manufacturer: Alpha & Omega Semiconductor; Rds On Max: 900mR; Input Capacitance: 263pF; Max Power Dissipation: 56.8W; Supplier: Digikey; Manufacturer Part Number: AOD4S60; RoHS: Yes; Item Type: Mosfet; Stock: 4197; Pricing: 1=1.32, 10=1.08, 100=0.8399, 500=0.71192, 1000=0.57994 (USD); Mounting Technology: Surface Mount; Case/Package: TO-252-3; Packaging: Cut Tape; Drain to Source Voltage (Vdss): 600V; Continuous Drain Current (ID): 4A; Series: aMOS™; Package Quantity: 1; RoHS Compliant: Yes; ComponentLink1URL: https://datasheet.ciiva.com/6367/aod4s60-6367632.pdf?src-supplier=Digikey; ComponentLink1Description: https://datasheet.ciiva.com/6367/aod4s60-6367632.pdf?src-supplier=Digikey
R1 R5 R10 = FRC0805F18R2TS: 125mW Thick Film Resistors 150V ±100ppm/℃ ±1% 18.2Ω 0805 Chip Resistor - Surface Mount ROHS; ComponentLink1Description: LCSC; ComponentLink1URL: *
R2 R3 = PA2512FKE7W0R03E: RES 0.03 OHM 1% 2W 2512; Manufacturer: Yageo; Item Type: Resistor; Supplier: Avnet; LCSC Part Number: C728311; Manufacturer Part Number: PA2512FKE7W0R03E; RoHS: No; Stock: 4000; Pricing: 1=0.655, 25=0.542, 50=0.453, 100=0.364, 250=0.314 (USD)
R4 R11 = RC0603FR-0710KL: RES SMD 10K Ohm 1% 1/10W 0603; Manufacturer: Yageo; Resistance: 10kR; Temperature Coefficient: 100ppm/°C; Voltage Rating (DC): 50V; Power Rating: 100mW; Voltage Rating: 75V; Item Type: Resistor; Supplier 1: Digi-Key; Manufacturer Part Number: RC0603FR-0710KL; RoHS: Yes; Category: Chip SMD Resistors; Stock 1: 25249139; Pricing 1: 1=0.10000, 10=0.02400, 100=0.00970, 1000=0.00436, 2500=0.00378 (USD); Case/Package: 0603; Number of Pins: 2; Case Code (Imperial): 0603; Case Code (Metric): 1608; Weight: 7.1E-05oz; Size Code: 0603; Min Operating Temperature: -55°C; Max Operating Temperature: 155°C; Tolerance: 1%; Resistor Type: Thick Film; Packaging: Tape and Reel; Termination: SMD/SMT; Features: Moisture Resistant; Series: RC; Max Power Dissipation: 100mW; Number of Terminations: 2; Resistance Tolerance: 1%; Construction: Rectangular; Length: 1.6mm; Width: 0.8mm; Height: 0.45mm; Depth: 0.8mm; Lead Pitch: 0.3mm; REACH SVHC: Unknown; Lead Free: Lead Free; Military Standard: Not; RoHS Compliant: Yes; ComponentLink1URL: https://datasheet.ciiva.com/7660/38590-7660789.pdf?src-supplier=Element14; ComponentLink1Description: https://datasheet.ciiva.com/7660/38590-7660789.pdf?src-supplier=Element14; ComponentLink2URL: https://datasheet.ciiva.com/7983/443971-7983596.pdf?src-supplier=Element14; ComponentLink2Description: https://datasheet.ciiva.com/7983/443971-7983596.pdf?src-supplier=Element14; ComponentLink3URL: https://datasheet.ciiva.com/22747/443971-22747519.pdf?src-supplier=Element14; ComponentLink3Description: https://datasheet.ciiva.com/22747/443971-22747519.pdf?src-supplier=Element14; ComponentLink4URL: https://datasheet.ciiva.com/46440/1868787-46440891.pdf?src-supplier=Element14; ComponentLink4Description: https://datasheet.ciiva.com/46440/1868787-46440891.pdf?src-supplier=Element14; ComponentLink5URL: https://datasheet.ciiva.com/7746/1738695-7746239.pdf?src-supplier=Element14; ComponentLink5Description: https://datasheet.ciiva.com/7746/1738695-7746239.pdf?src-supplier=Element14; ComponentLink6URL: https://datasheet.ciiva.com/15189/getdatasheetpartid-409289-15189591.pdf?src-supplier=Verical; ComponentLink6Description: https://datasheet.ciiva.com/15189/getdatasheetpartid-409289-15189591.pdf?src-supplier=Verical; Supplier Part Number 1: 311-10.0KHRCT-ND; LCSC Part Number: C98220
R6 = RC0603FR-0749K9L: RES 49.9K OHM 1% 1/10W 0603; Manufacturer: Yageo; Power Rating: 100mW; Resistance: 49.9kR; Temperature Coefficient: 100ppm/°C; Voltage Rating (DC): 50V; Item Type: Resistor; Supplier 1: Digi-Key; Manufacturer Part Number: RC0603FR-0749K9L; RoHS: Yes; Category: Chip SMD Resistors; Stock 1: 77863; Pricing 1: 1=0.10000, 10=0.02400, 100=0.00970, 1000=0.00436, 2500=0.00378 (USD); Mount: Surface Mount; Case/Package: 0603; Case Code (Metric): 1608; Case Code (Imperial): 0603; Size Code: 0603; Min Operating Temperature: -55°C; Max Operating Temperature: 155°C; Tolerance: 1%; Packaging: Tape and Reel; Package Quantity: 1; Voltage Rating: 50V; Resistor Type: Thick Film; Number of Terminations: 2; Termination: SMD/SMT; Max Power Dissipation: 100mW; Features: Moisture Resistant; Series: RC; Construction: Rectangular; Length: 0.063inch; Width: 0.031inch; Height: 0.022inch; Depth: 0.8mm; Lead Free: Lead Free; Military Standard: Not; RoHS Compliant: Yes; ComponentLink1URL: https://datasheet.ciiva.com/2454/pyu-r-int-thick-7-2454042.pdf?src-supplier=Digi-Key; ComponentLink1Description: https://datasheet.ciiva.com/2454/pyu-r-int-thick-7-2454042.pdf?src-supplier=Digi-Key; ComponentLink2URL: https://datasheet.ciiva.com/2454/pyu-r-int-thick-7-2454043.pdf?src-supplier=Digi-Key; ComponentLink2Description: https://datasheet.ciiva.com/2454/pyu-r-int-thick-7-2454043.pdf?src-supplier=Digi-Key; ComponentLink3URL: https://datasheet.ciiva.com/2454/pyu-r-int-thick-7-2454044.pdf?src-supplier=Digi-Key; ComponentLink3Description: https://datasheet.ciiva.com/2454/pyu-r-int-thick-7-2454044.pdf?src-supplier=Digi-Key; ComponentLink4URL: https://datasheet.ciiva.com/15189/getdatasheetpartid-323805-15189749.pdf?src-supplier=Verical; ComponentLink4Description: https://datasheet.ciiva.com/15189/getdatasheetpartid-323805-15189749.pdf?src-supplier=Verical; Supplier Part Number 1: 311-49.9KHRCT-ND; LCSC Part Number: C114624
R7 R9 = RC0603FR-072R2L: RES 2.2 OHM 1% 1/10W 0603; Manufacturer: Yageo; Item Type: Resistors; Voltage Rating: 50V; Power Rating: 100mW; Temperature Coefficient: 200ppm/°C; Supplier: Digikey; LCSC Part Number: C112307; Manufacturer Part Number: RC0603FR-072R2L; RoHS: Yes; Stock: 331140; Pricing: 1=0.1, 10=0.029, 50=0.0188, 100=0.0158, 500=0.01094, 1000=0.00947 (USD); Case/Package: 0603; Pins: 2; Case Code (Metric): 1608; Case Code (Imperial): 0603; Min Operating Temperature: -55°C; Max Operating Temperature: 155°C; Voltage Rating (DC): 50V; Package Quantity: 1; Value: 2.2R; Tolerance: 1%; Packaging: Tape and Reel; Resistor Type: Thick Film; Number of Terminations: 2; Termination: SMD/SMT; Max Power Dissipation: 100mW; Features: Moisture Resistant; Series: RC; Technology: THICK FILM; Resistance Tolerance: 1%; Length: 0.063inch; Width: 0.031inch; Height: 0.022inch; Depth: 0.8mm; Reach SVHC Compliant: No; Lead Free: Lead Free; RoHS Compliant: Yes; ComponentLink1URL: https://datasheet.ciiva.com/11808/0900766b80f96399-11808160.pdf?src-supplier=Rs; ComponentLink1Description: https://datasheet.ciiva.com/11808/0900766b80f96399-11808160.pdf?src-supplier=Rs; ComponentLink2URL: https://datasheet.ciiva.com/2554/pyu-r-int-thick-7-2554421.pdf?src-supplier=Digikey; ComponentLink2Description: https://datasheet.ciiva.com/2554/pyu-r-int-thick-7-2554421.pdf?src-supplier=Digikey; ComponentLink3URL: https://datasheet.ciiva.com/2554/pyu-r-int-thick-7-2554422.pdf?src-supplier=Digikey; ComponentLink3Description: https://datasheet.ciiva.com/2554/pyu-r-int-thick-7-2554422.pdf?src-supplier=Digikey; ComponentLink4URL: https://datasheet.ciiva.com/2554/pyu-r-int-thick-7-2554420.pdf?src-supplier=Digikey; ComponentLink4Description: https://datasheet.ciiva.com/2554/pyu-r-int-thick-7-2554420.pdf?src-supplier=Digikey
R8 R12 = CRCW040210R0FKEDHP: RES SMD 10 OHM 1% 1/5W 0402; Manufacturer: Vishay Dale; Power Rating: 125mW; Voltage Rating: 50V; Temperature Coefficient: 100ppm/°C; Max Power Dissipation: 200mW; Supplier 1: Digi-Key; Manufacturer Part Number: CRCW040210R0FKEDHP; Stock 1: 28500; Pricing 1: 1=0.15, 10=0.132, 100=0.0506, 1000=0.02226, 2500=0.01923, 5000=0.0172 (USD); Mount: Surface Mount; Case/Package: 0402; Weight: 2.3E-05oz; Case Code (Imperial): 0402; Case Code (Metric): 1005; Contact Plating: Tin; Min Operating Temperature: -55°C; Max Operating Temperature: 155°C; Resistance: 10R; Tolerance: 1%; Packaging: Tape and Reel; Package Quantity: 10000; Termination: SMD/SMT; Resistor Type: Thick Film; Voltage Rating (DC): 50V; Features: Automotive AEC-Q200; Series: CRCW-HP; Number of Terminations: 2; Resistance Tolerance: 1%; Technology: THICK FILM; Construction: Rectangular; Length: 1mm; Width: 0.5mm; Height: 0.3mm; Depth: 0.5mm; Radiation Hardening: No; REACH SVHC: Unknown; Military Standard: Not; Lead Free: Lead Free; RoHS Compliant: Yes; ComponentLink1URL: http://www.mouser.com/ds/2/427/crcwhpe3-46056.pdf?src-supplier=Mouser; ComponentLink1Description: http://www.mouser.com/ds/2/427/crcwhpe3-46056.pdf?src-supplier=Mouser; Supplier Part Number 1: 541-10.0YCT-ND; LCSC Part Number: C4013850
R13 R17 R21 R36 = CR1206F42704G: 250mW 200V ±1% 2.7MΩ 1206 Chip Resistor - Surface Mount ROHS; Manufacturer: LIZ Elec; Manufacturer Part Number: CR1206F42704G; Package: 1206; LCSC Part Number: C3037509; Item Type: Resistor; ComponentLink1Description: LCSC; ComponentLink1URL: https://www.lcsc.com/product-detail/Chip-Resistor-Surface-Mount_LIZ-Elec-CR1206F42704G_C3037509.html
R14 R22 = FRC0603F1652TS: 100mW Thick Film Resistors 75V ±100ppm/℃ ±1% 16.5kΩ 0603 Chip Resistor - Surface Mount ROHS; Manufacturer: FOJAN; Manufacturer Part Number: FRC0603F1652TS; Package: 0603; LCSC Part Number: C2933155; Item Type: Resistor; ComponentLink1Description: LCSC; ComponentLink1URL: https://www.lcsc.com/product-detail/Chip-Resistor-Surface-Mount_FOJAN-FRC0603F1652TS_C2933155.html
R15 = RC1206FR-073M09L: RES 3.09M OHM 1% 1/4W 1206; Manufacturer: Yageo; Item Type: Resistor; Temperature Coefficient: 100ppm/°C; Max Power Dissipation: 250mW; Voltage Rating (DC): 200V; Supplier: Mouser; LCSC Part Number: C488771; Manufacturer Part Number: RC1206FR-073M09L; RoHS: Yes; Stock: 10394; Pricing: 1=0.1, 10=0.025, 50=0.025, 100=0.015, 1000=0.013, 10000=0.01 (USD); Case/Package: 1206; Contact Plating: Tin,Matte; Case Code (Metric): 3216; Case Code (Imperial): 1206; Min Operating Temperature: -55°C; Max Operating Temperature: 155°C; Value: 3.09MR; Tolerance: 1%; Package Quantity: 1; Packaging: Cut Tape; Number of Terminations: 2; Features: Moisture Resistant; Series: RC; Length: 0.122inch; Width: 0.063inch; Height: 0.026inch; Lead Free: Lead Free; RoHS Compliant: Yes; ComponentLink1URL: https://datasheet.ciiva.com/2461/pyu-rc1206-51-rohs-l-4-2461290.pdf?src-supplier=Digikey; ComponentLink1Description: https://datasheet.ciiva.com/2461/pyu-rc1206-51-rohs-l-4-2461290.pdf?src-supplier=Digikey; ComponentLink2URL: https://datasheet.ciiva.com/2461/pyu-rc1206-51-rohs-l-4-2461291.pdf?src-supplier=Digikey; ComponentLink2Description: https://datasheet.ciiva.com/2461/pyu-rc1206-51-rohs-l-4-2461291.pdf?src-supplier=Digikey; ComponentLink3URL: https://datasheet.ciiva.com/2461/pyu-rc1206-51-rohs-l-4-2461292.pdf?src-supplier=Digikey; ComponentLink3Description: https://datasheet.ciiva.com/2461/pyu-rc1206-51-rohs-l-4-2461292.pdf?src-supplier=Digikey
R16 = RT0603BRD0710KL: RES SMD 10K OHM 0.1% 1/10W 0603; Manufacturer: Yageo; Power: 100mW; Rated Temperature: 70°C; Value: 10kR; Temperature Coefficient: 25ppm/°C; Working Voltage: 75V; Package Height: 0.45mm; Package Length: 1.6mm; Package Width: 0.8mm; Item Type: Resistor; Supplier 1: Rs; Manufacturer Part Number: RT0603BRD0710KL; RoHS: Yes; Category: Chip SMD Resistors; Stock 1: 20510; Pricing 1: 100=0.29800, 250=0.27800, 500=0.25900, 1000=0.23700 (GBP); Mounting Technology: Surface Mount; Pins: 2; Case/Package: 0603; Min Operating Temperature: -55°C; Max Operating Temperature: 155°C; Tolerance: 0.1%; Resistor Type: FIXED RESISTOR; Construction: Chip; Package Style: SMTMeter; Packaging: Tape and Reel; Technology: THIN FILM; Termination: Wraparound; Reach SVHC Compliant: Yes; RoHS Compliant: Yes; ComponentLink1URL: https://datasheet.ciiva.com:443/pdfs/VipMasterIC/IC/YAGO/YAGO-S-A0008510989/YAGO-S-A0008510989-1.pdf?src-supplier=IHS+Markit; ComponentLink1Description: https://datasheet.ciiva.com:443/pdfs/VipMasterIC/IC/YAGO/YAGO-S-A0008510989/YAGO-S-A0008510989-1.pdf?src-supplier=IHS+Markit; ComponentLink2URL: https://datasheet.ciiva.com/5624/pyu-rt-1-to-0-05-rohs-l-4-5624351.pdf?src-supplier=Mouser; ComponentLink2Description: https://datasheet.ciiva.com/5624/pyu-rt-1-to-0-05-rohs-l-4-5624351.pdf?src-supplier=Mouser; ComponentLink3URL: https://datasheet.ciiva.com/29721/pyu-rt-1-to-0-05-rohs-l-4-29721177.pdf?src-supplier=Digi-Key; ComponentLink3Description: https://datasheet.ciiva.com/29721/pyu-rt-1-to-0-05-rohs-l-4-29721177.pdf?src-supplier=Digi-Key; Supplier Part Number 1: 1991391P; LCSC Part Number: C95204